# Altium project PCB_Project.PrjPcb
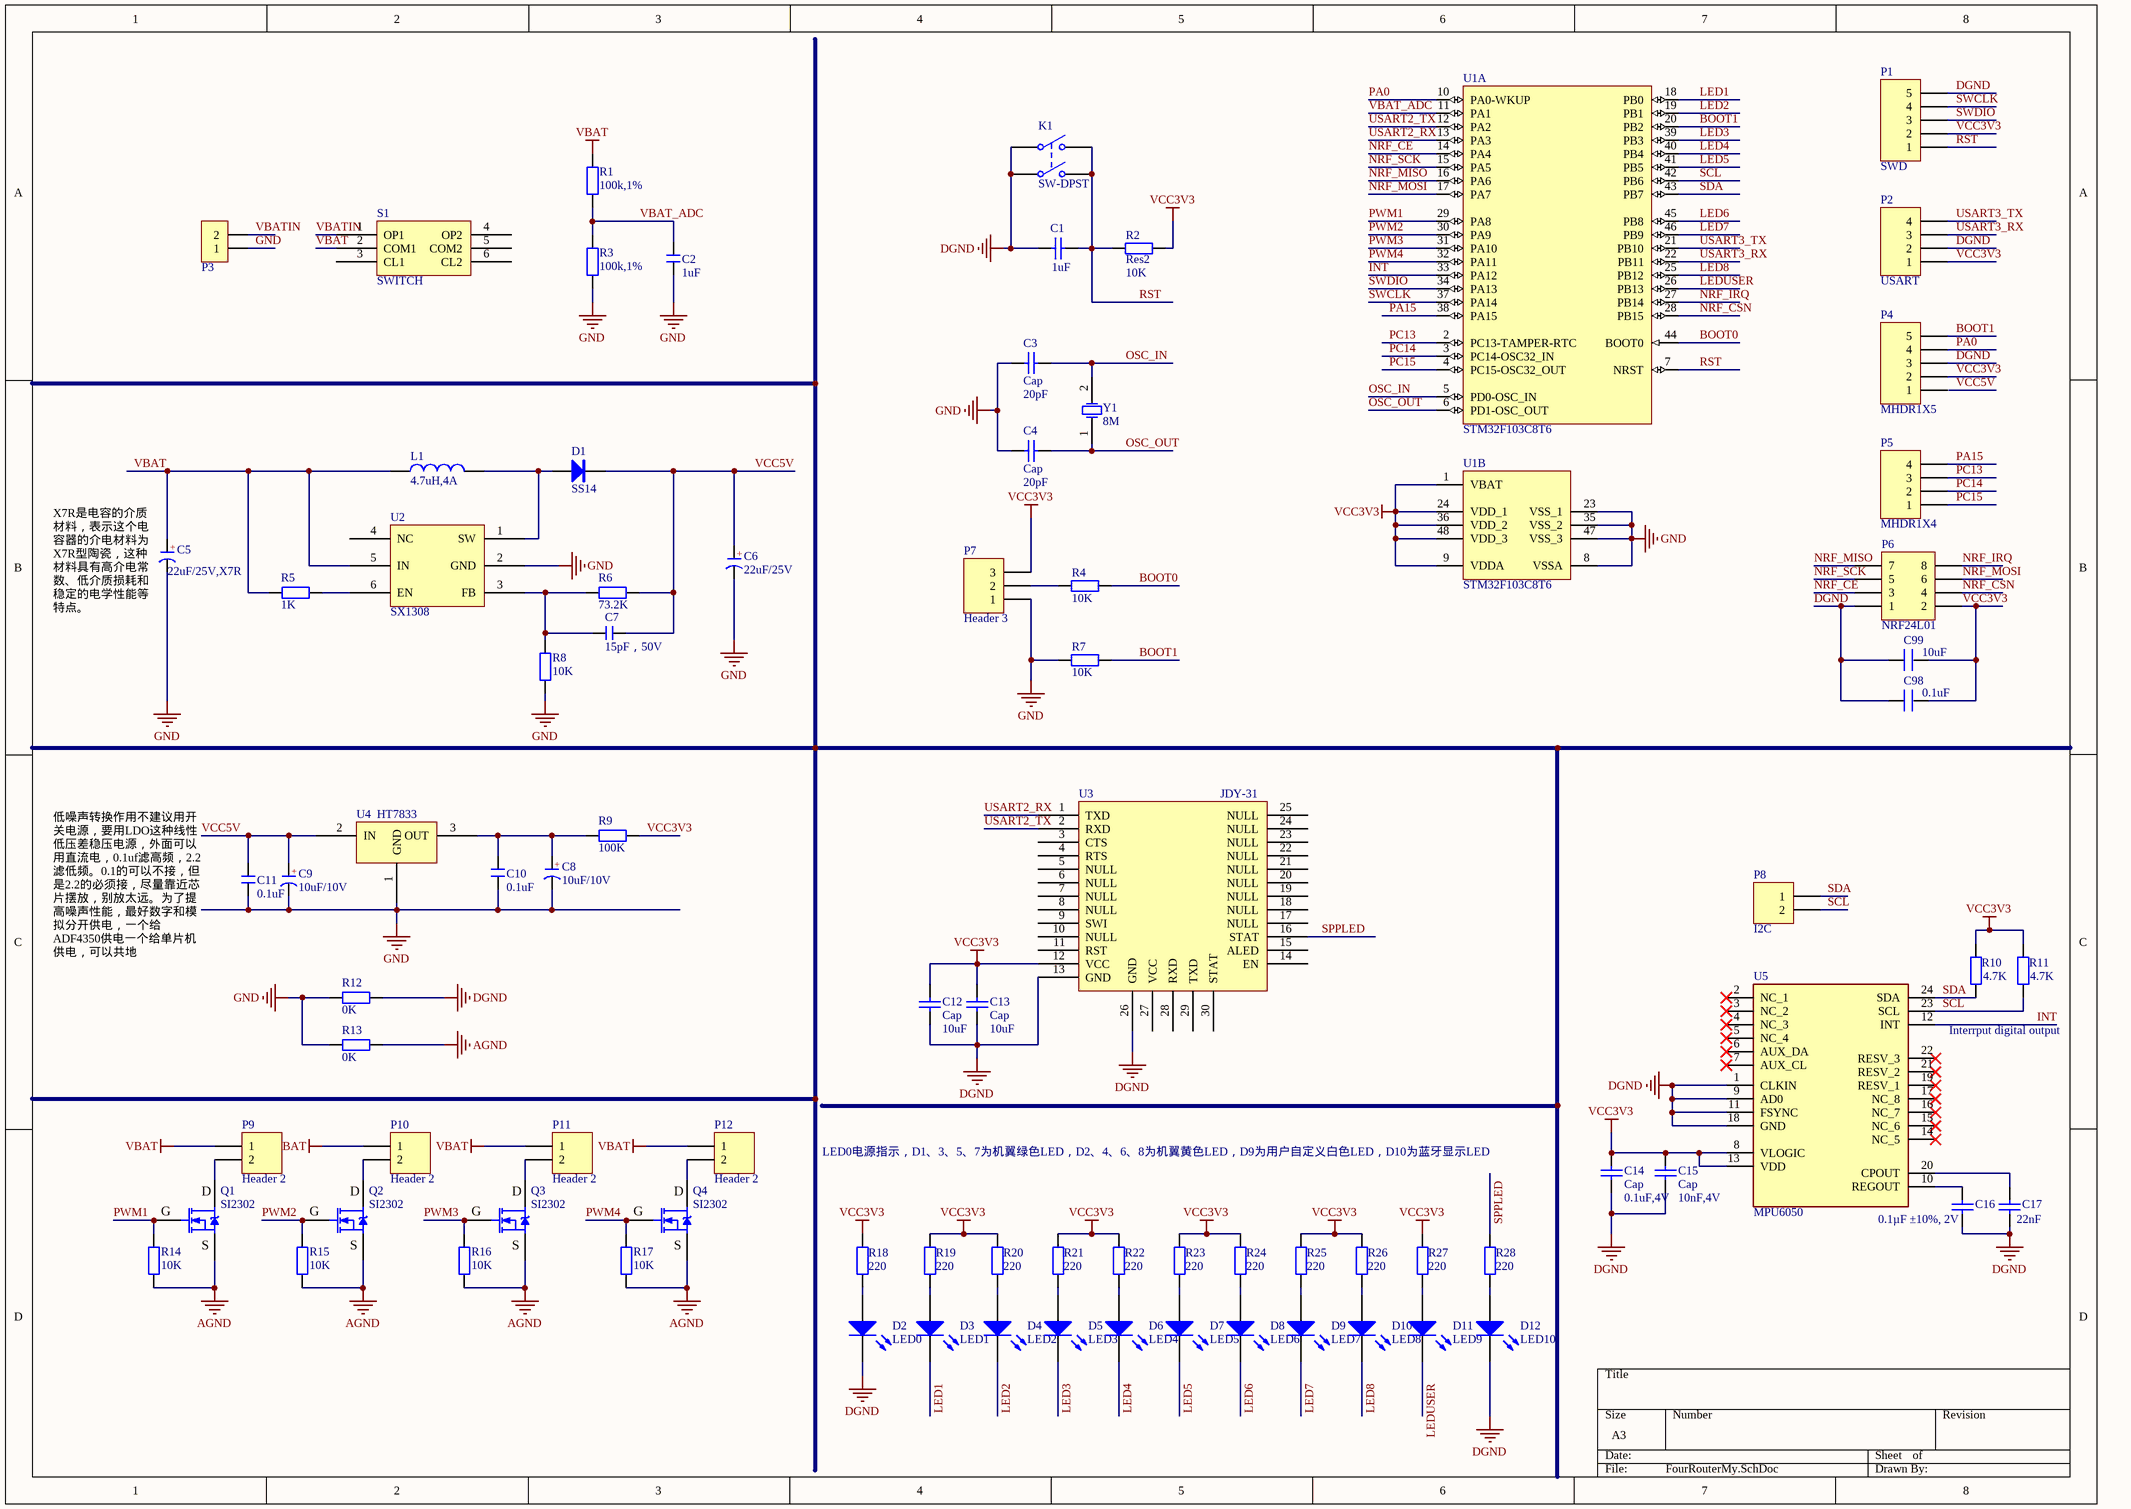
[diagram p0: FourRouterMy.SchDoc]
1 sheet, 84 parts. Net scope: global (net labels, ports and power ports of the same name join across sheets).
Board file: FourRouterMy.PcbDoc

## Sheet FourRouterMy.SchDoc
size A3

### Parts
C1  value 1uF  [0603C]  (hidden comment: Cap)
C2  1uF  [0603C]
C3  Cap  value 20pF  [0603C]
C4  Cap  value 20pF  [0603C]
C5  22uF/25V,X7R  [1206C]
C6  22uF/25V  [1206C]
C7  15pF，50V  [0603C]
C8  10uF/10V  [1206C]
C9  10uF/10V  [1206C]
C10  0.1uF  [0603C]
C11  0.1uF  [0603C]
C12  Cap  value 10uF  [0603C]
C13  Cap  value 10uF  [0603C]
C14  Cap  value 0.1uF,4V  [0603C]
C15  Cap  value 10nF,4V  [0603C]
C16  value 0.1µF ±10%, 2V  [0603C]  (hidden comment: Cap)
C17  value 22nF  [0603C]  (hidden comment: Cap)
C98  value 0.1uF  [0603C]  (hidden comment: 1uF)
C99  value 10uF  [C 0805_L]  (hidden comment: 1uF)
D1  SS14  [SMA]
D2  LED0  [LED 0603R]
D3  LED1  [LED 0603G]
D4  LED2  [LED 0603Y]
D5  LED3  [LED 0603G]
D6  LED4  [LED 0603Y]
D7  LED5  [LED 0603G]
D8  LED6  [LED 0603Y]
D9  LED7  [LED 0603G]
D10  LED8  [LED 0603Y]
D11  LED9  [LED 0603W]
D12  LED10  [LED 0603B]
K1  SW-DPST  [TSW DIP-6*6*6]
L1  4.7uH,4A  [L 1812]
P1  SWD  [XH2.54-WI-5P]
P2  USART  [XH2.54-WI-4P]
P3  HDR-1X2  [HDR1X2]  (value not drawn)
P4  MHDR1X5  [HDR2.54-LI-5P]
P5  MHDR1X4  [HDR2.54-LI-4P]
P6  NRF24L01  [HDR2.54-M-LS-2x4P]
P7  Header 3  [HDR1X3]
P8  I2C  [HDR1X2]
P9  Header 2  [HDR1X2]
P10  Header 2  [HDR1X2]
P11  Header 2  [HDR1X2]
P12  Header 2  [HDR1X2]
Q1  SI2302  [SOT23-3N]
Q2  SI2302  [SOT23-3N]
Q3  SI2302  [SOT23-3N]
Q4  SI2302  [SOT23-3N]
R1  100k,1%  [0603R]
R2  Res2  value 10K  [0603R]
R3  100k,1%  [0603R]
R4  value 10K  [0603R]  (hidden comment: Res2)
R5  1K  [0603R]
R6  73.2K  [0603R]
R7  value 10K  [0603R]  (hidden comment: Res2)
R8  10K  [0603R]
R9  100K  [0603R]
R10  value 4.7K  [0603R]  (hidden comment: Res2)
R11  value 4.7K  [0603R]  (hidden comment: Res2)
R12  0K  [0603R]
R13  0K  [0603R]
R14  10K  [0603R]
R15  10K  [0603R]
R16  10K  [0603R]
R17  10K  [0603R]
R18  value 220  [0603R]  (hidden comment: 2)
R19  value 220  [0603R]  (hidden comment: Res2)
R20  value 220  [0603R]  (hidden comment: Res2)
R21  value 220  [0603R]  (hidden comment: Res2)
R22  value 220  [0603R]  (hidden comment: Res2)
R23  value 220  [0603R]  (hidden comment: Res2)
R24  value 220  [0603R]  (hidden comment: Res2)
R25  value 220  [0603R]  (hidden comment: Res2)
R26  value 220  [0603R]  (hidden comment: Res2)
R27  value 220  [0603R]  (hidden comment: Res2)
R28  value 220  [0603R]  (hidden comment: Res2)
S1  SWITCH  [SS-12F23]
U1  STM32F103C8T6  [LQFP-48_M]  (parts A,B of 2)
U2  SX1308  [SOT23-6]
U3  JDY-31  [JDY-31-SMD]
U4  HT7833  [SOT-89]
U5  MPU6050  [MPU6050]
Y1  8M  [OSC HC-49S]

### Nets
AGND: Q1.2(S) Q2.2(S) Q3.2(S) Q4.2(S) R13.2 R14.1 R15.1 R16.1 R17.1
DGND: C1.1 C12.1 C13.1 C14.1 C15.1 C16.1 C17.1 C98.1 C99.1 D2.2(K) D12.2(K) K1.1(COMMON1) K1.3(COMMON2) P1.5 P2.2 P4.3 P6.1 R12.2 U3.13(GND) U3.26(GND) U5.1(CLKIN) U5.9(AD0) U5.11(FSYNC) U5.18(GND)
GND: C2.2 C3.1 C4.1 C5.2(K) C6.2(K) C8.2(K) C9.2(K) C10.1 C11.1 P3.1 P7.1 R3.1 R7.1 R8.1 R12.1 R13.1 U1.8(VSSA) U1.23(VSS_1) U1.35(VSS_2) U1.47(VSS_3) U2.2(GND) U4.1(GND)
VBAT: C5.1(A) L1.1 P9.1 P10.1 P11.1 P12.1 R1.2 R5.1 S1.2(COM1) U2.5(IN)
VCC3V3: C12.2 C13.2 C14.2 C15.2 C98.2 C99.2 P1.2 P2.1 P4.2 P6.2 P7.3 R2.2 R9.1 R10.2 R11.2 R18.2 R19.2 R20.2 R21.2 R22.2 R23.2 R24.2 R25.2 R26.2 R27.2 U1.1(VBAT) U1.9(VDDA) U1.24(VDD_1) U1.36(VDD_2) U1.48(VDD_3) U3.12(VCC) U5.8(VLOGIC) U5.13(VDD)
BOOT0: R4.2 U1.44(BOOT0)
BOOT1: P4.5 R7.2 U1.20(PB2)
INT: U1.33(PA12) U5.12(INT)
LED1: D3.2(K) U1.18(PB0)
LED2: D4.2(K) U1.19(PB1)
LED3: D5.2(K) U1.39(PB3)
LED4: D6.2(K) U1.40(PB4)
LED5: D7.2(K) U1.41(PB5)
LED6: D8.2(K) U1.45(PB8)
LED7: D9.2(K) U1.46(PB9)
LED8: D10.2(K) U1.25(PB12)
LEDUSER: D11.2(K) U1.26(PB13)
NRF_CE: P6.3 U1.14(PA4)
NRF_CSN: P6.4 U1.28(PB15)
NRF_IRQ: P6.8 U1.27(PB14)
NRF_MISO: P6.7 U1.16(PA6)
NRF_MOSI: P6.6 U1.17(PA7)
NRF_SCK: P6.5 U1.15(PA5)
OSC_IN: C3.2 U1.5(PD0-OSC_IN) Y1.2(OSC2)
OSC_OUT: C4.2 U1.6(PD1-OSC_OUT) Y1.1(OSC1)
PA0: P4.4 U1.10(PA0-WKUP)
PA15: P5.4 U1.38(PA15)
PC13: P5.3 U1.2(PC13-TAMPER-RTC)
PC14: P5.2 U1.3(PC14-OSC32_IN)
PC15: P5.1 U1.4(PC15-OSC32_OUT)
PWM1: Q1.1(G) R14.2 U1.29(PA8)
PWM2: Q2.1(G) R15.2 U1.30(PA9)
PWM3: Q3.1(G) R16.2 U1.31(PA10)
PWM4: Q4.1(G) R17.2 U1.32(PA11)
RST: C1.2 K1.2(NO1) K1.4(NO2) P1.1 R2.1 U1.7(NRST)
SCL: P8.2 R11.1 U1.42(PB6) U5.23(SCL)
SDA: P8.1 R10.1 U1.43(PB7) U5.24(SDA)
SPPLED: R28.2 U3.16(STAT)
SWCLK: P1.4 U1.37(PA14)
SWDIO: P1.3 U1.34(PA13)
USART2_RX: U1.13(PA3) U3.1(TXD)
USART2_TX: U1.12(PA2) U3.2(RXD)
USART3_RX: P2.3 U1.22(PB11)
USART3_TX: P2.4 U1.21(PB10)
VBAT_ADC: C2.1 R1.1 R3.2 U1.11(PA1)
VBATIN: P3.2 S1.1(OP1)
VCC5V: C6.1(A) C7.2 C9.1(A) C11.2 D1.2(K) R6.2 U4.2(IN)
NetC7_1: C7.1 R6.1 R8.2 U2.3(FB)
NetC8_1: C8.1(A) C10.2 R9.2 U4.3(OUT)
NetC16_2: C16.2 U5.10(REGOUT)
NetC17_2: C17.2 U5.20(CPOUT)
NetD1_1: D1.1(A) L1.2 U2.1(SW)
NetD2_1: D2.1(A) R18.1
NetD3_1: D3.1(A) R19.1
NetD4_1: D4.1(A) R20.1
NetD5_1: D5.1(A) R21.1
NetD6_1: D6.1(A) R22.1
NetD7_1: D7.1(A) R23.1
NetD8_1: D8.1(A) R24.1
NetD9_1: D9.1(A) R25.1
NetD10_1: D10.1(A) R26.1
NetD11_1: D11.1(A) R27.1
NetD12_1: D12.1(A) R28.1
NetP7_2: P7.2 R4.1
NetP9_2: P9.2 Q1.3(D)
NetP10_2: P10.2 Q2.3(D)
NetP11_2: P11.2 Q3.3(D)
NetP12_2: P12.2 Q4.3(D)
NetR5_2: R5.2 U2.6(EN)

Not connected (* = marked no-connect by the designer): P4 1; S1 3(CL1) 4(OP2) 5(COM2) 6(CL2); U2 4(NC); U3 3(CTS) 4(RTS) 5(NULL) 6(NULL) 7(NULL) 8(NULL) 9(SWI) 10(NULL) 11(RST) 14(EN) 15(ALED) 17(NULL) 18(NULL) 19(NULL) 20(NULL) 21(NULL) 22(NULL) 23(NULL) 24(NULL) 25(NULL) 27(VCC) 28(RXD) 29(TXD) 30(STAT); U5 2(NC_1)* 3(NC_2)* 4(NC_3)* 5(NC_4)* 6(AUX_DA)* 7(AUX_CL)* 14(NC_5)* 15(NC_6)* 16(NC_7)* 17(NC_8)* 19(RESV_1)* 21(RESV_2)* 22(RESV_3)*

### Notes on the sheet
- (near C5) X7R是电容的介质材料，表示这个电容器的介电材料为X7R型陶瓷，这种材料具有高介电常数、低介质损耗和稳定的电学性能等特点。
- (near C11) 低噪声转换作用不建议用开关电源，要用LDO这种线性低压差稳压电源，外面可以用直流电，0.1uf滤高频，2.2滤低频。0.1的可以不接，但是2.2的必须接，尽量靠近芯片摆放，别放太远。为了提高噪声性能，最好数字和模拟分开供电，一个给ADF4350供电一个给单片机供电，可以共地
- Interrput digital output
- LED0电源指示，D1、3、5、7为机翼绿色LED，D2、4、6、8为机翼黄色LED，D9为用户自定义白色LED，D10为蓝牙显示LED
- (in symbol C-CM) +

### Library data of the parts
C1 C3 C4 C12-C17 = Cap: Capacitor; Published: 8-Jun-2000; LatestRevisionDate: 17-Jul-2002; LatestRevisionNote: Re-released for DXP Platform.; PackageReference: RAD-0.3; Publisher: Altium Limited; PackageDescription: Radial Cap, Thru-Hole; 2 Leads; 0.3 in Pin Spacing
C2 C7 C10 C11 = C: 无极性贴片电容; 版权归属: 源创客; BOM名称: 无极性贴片电容; 学习资源: www.ooocke.com
C5 C6 C8 C9 = C-CM: 贴片电解电容; 版权归属: 源创客; BOM名称: 贴片电解电容; 学习资源: www.ooocke.com
C98 C99 = C_1
D1 = SS14: 肖特基二极管; 版权归属: 源创客; 属性: 40V/1A; BOM名称: 肖特基二极管; 学习资源: www.ooocke.com
D2-D12 = LED0: Typical INFRARED GaAs LED; Published: 8-Jun-2000; LatestRevisionDate: 08-Jul-2005; LatestRevisionNote: Mech Layer 1 removed.; PackageReference: LED-0; Publisher: Altium Limited; PackageDescription: LED; 2 Leads
K1 = SW-DPST: Double-Pole, Single-Throw Switch; Published: 24-Mar-1999; LatestRevisionDate: 17-Jul-2002; LatestRevisionNote: Re-released for DXP Platform.; PackageReference: DPST-4; Publisher: Altium Limited; PackageDescription: Switch; 4 Leads
L1 = L: 小功率贴片电感; 版权归属: 源创客; BOM名称: 小功率贴片电感; 学习资源: www.ooocke.com
P1 P4 = MHDR1X5: Header, 5-Pin; LatestRevisionDate: 17-Jul-2002; LatestRevisionNote: Re-released for DXP Platform.; Publisher: Altium Limited
P2 P5 = MHDR1X4: Header, 4-Pin; LatestRevisionDate: 17-Jul-2002; LatestRevisionNote: Re-released for DXP Platform.; Publisher: Altium Limited
P3 = Header 2: 2P接插件; 版权归属: 源创客; BOM名称: 2P接插件; 学习资源: www.ooocke.com
P6 = MHDR2X4: Header, 4-Pin, Dual row; LatestRevisionDate: 17-Jul-2002; LatestRevisionNote: Re-released for DXP Platform.; Publisher: Altium Limited
P7 = Header 3: Header, 3-Pin; LatestRevisionDate: 17-Jul-2002; LatestRevisionNote: Re-released for DXP Platform.; Publisher: Altium Limited
P8-P12 = Header 2: Header, 2-Pin; LatestRevisionDate: 17-Jul-2002; LatestRevisionNote: Re-released for DXP Platform.; Publisher: Altium Limited
Q1-Q4 = SI2302: N沟道场效应管; 版权归属: 源创客; BOM名称: N沟道场效应管; 学习资源: www.ooocke.com
R1 R3 R5 R6 R8 R9 R12-R17 = R: 贴片电阻; 版权归属: 源创客; BOM名称: 贴片电阻; 学习资源: www.ooocke.com
R2 R4 R7 R10 R11 R18-R28 = Res2: Resistor; Published: 8-Jun-2000; LatestRevisionDate: 17-Jul-2002; LatestRevisionNote: Re-released for DXP Platform.; PackageReference: AXIAL-0.4; Publisher: Altium Limited; PackageDescription: Axial Device, Thru-Hole; 2 Leads; 0.4 in Pin Spacing
U1 = STM32F103C8T6: ARM Cortex-M3 32-bit MCU, 64 KB Flash, 20 KB Internal RAM, 37 I/Os, 48-pin LQFP, -40 to 85 degC, Tray; A/D Converter: 2x12-bit (10 Channel); FLASH Size (Prog) (kB): 64; I/Os (High Current): 37; Internal RAM Size (kB): 20; Operating Frequency(F) (Processor speed) (MHz): 72; Supply Voltage(Vcc) min (V): 2; DatasheetVersion: Rev. 16; PackageVersion: Rev. 6, 06/2013; PackageReference: LQFP48; PackageDescription: 48-Pin Low Profile Quad Flat Package, 7 x 7 mm Body, 0.5 mm Pitch; Supplier 1: Digi-Key; Supplier Part Number 1: 497-6063-ND; Supplier 2: Farnell; Supplier Part Number 2: 1447637; Supplier 3: Newark; Supplier Part Number 3: 59M2182; Supplier 4: Newark; Supplier Part Number 4: 57P1222; Supplier 5: Mouser; Supplier Part Number 5: 511-STM32F103C8T6; Core: ARM Cortex-M3; Packing: Tray; Mounting Technology: Surface Mount; PartNumber: STM32F103C8T6; ComponentLink1Description: Manufacturer URL; ComponentLink1URL: http://www.st.com/web/en/home.html; ComponentLink2Description: Datasheet; ComponentLink2URL: http://www.st.com/st-web-ui/static/active/en/resource/technical/document/datasheet/CD00161566.pdf; ComponentLink3Description: Package Specification; ComponentLink3URL: http://www.st.com/st-web-ui/static/active/en/resource/technical/document/datasheet/DM00058181.pdf
U3 = SPP-C
U5 = MPU6050: Accelerometer and Gyroscope Digital Output 2.5V/3.3V 24-Pin QFN EP; Manufacturer_Name: TDK; Geometry.Height: 0.95mm; Mouser Part Number: *; Mouser Price/Stock: *; Manufacturer_Part_Number: MPU6050; Datasheet Link: https://invensense.tdk.com/wp-content/uploads/2015/02/MPU-6000-Datasheet1.pdf
Y1 = XTAL: Crystal Oscillator; Published: 8-Jun-2000; LatestRevisionDate: 17-Jul-2002; LatestRevisionNote: Re-released for DXP Platform.; PackageReference: R38; Publisher: Altium Limited; PackageDescription: Crystal, Thru-Hole; 2 Leads; Body 3.1 x 8.2 mm (Dia.xH)